# Altium schematic sheet Power.SchDoc
size A3
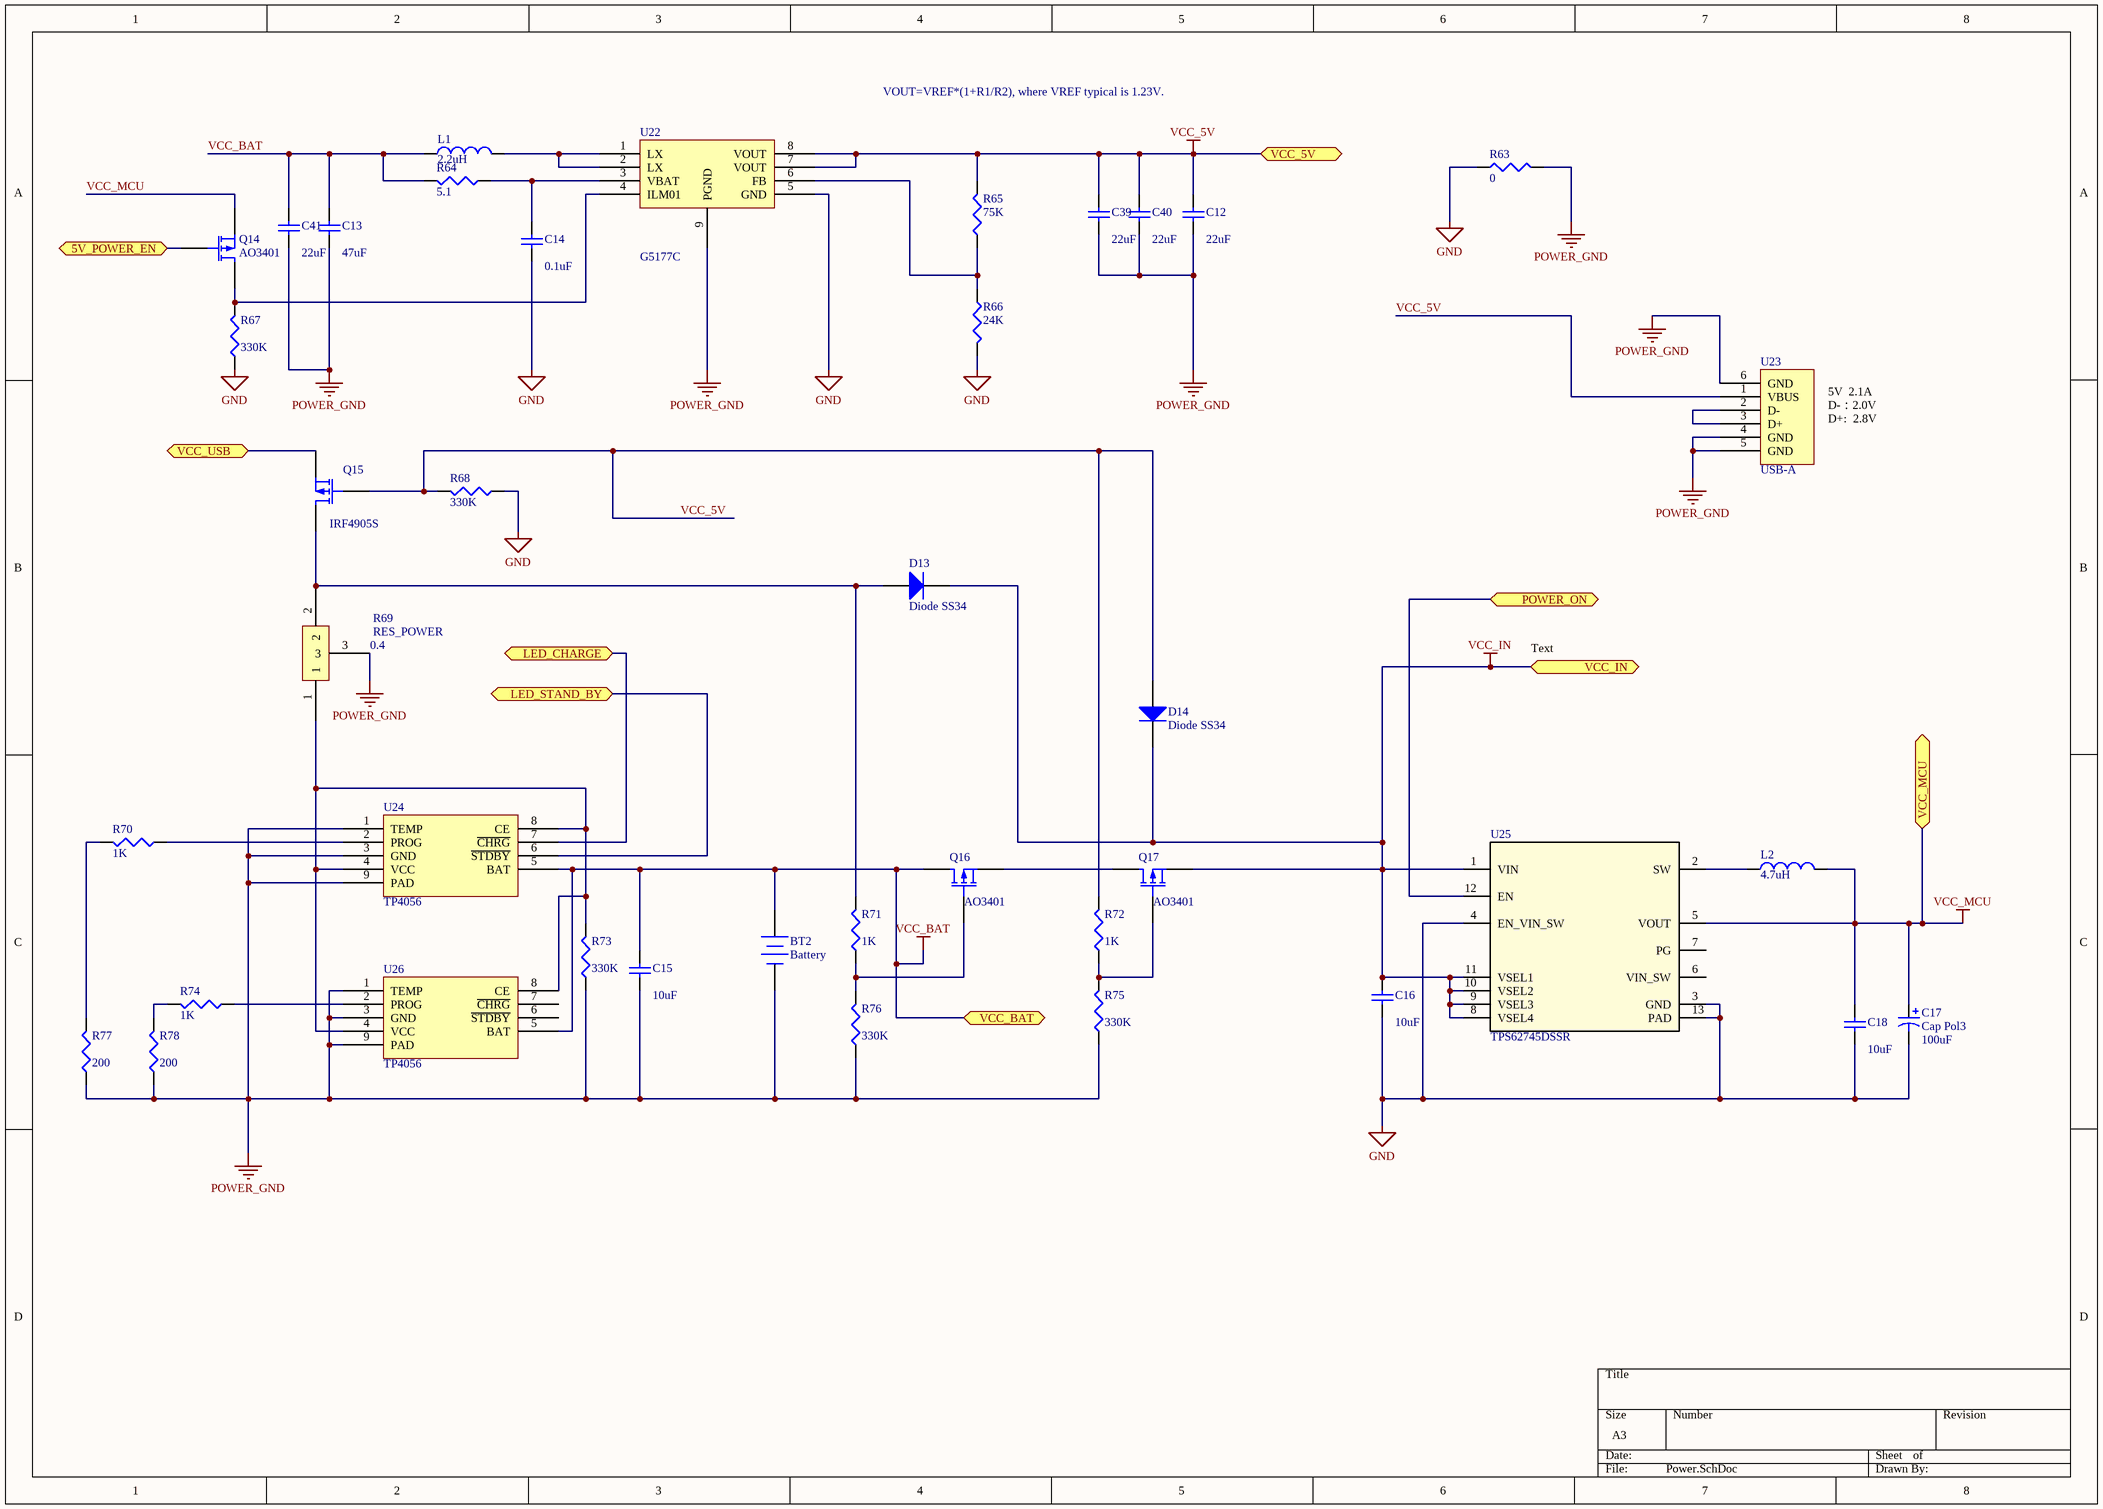
[diagram p0: Power.SchDoc]

## Parts
BT2  Battery  [18650X4]
C12  value 22uF  [1206]  (hidden comment: Cap Semi)
C13  value 47uF  [1210]  (hidden comment: Cap Semi)
C14  value 0.1uF  [0603]  (hidden comment: Cap Semi)
C15  value 10uF  [0603]  (hidden comment: Cap Semi)
C16  value 10uF  [0603]  (hidden comment: Cap Semi)
C17  Cap Pol3  value 100uF  [TC7343-2917]
C18  value 10uF  [0603]  (hidden comment: Cap Semi)
C39  value 22uF  [1206]  (hidden comment: Cap Semi)
C40  value 22uF  [1206]  (hidden comment: Cap Semi)
C41  value 22uF  [1206]  (hidden comment: Cap Semi)
D13  Diode SS34  [SMA]
D14  Diode SS34  [SMA]
L1  value 2.2uH  [WNC0630]  (hidden comment: Inductor)
L2  value 4.7uH  [2520]  (hidden comment: Inductor)
Q14  AO3401  [SOT23-3-PMOS]
Q15  IRF4905S  [D2PAK]
Q16  AO3401  [SOT23-3-PMOS]
Q17  AO3401  [SOT23-3-PMOS]
R63  value 0  [0603]  (hidden comment: Res3)
R64  value 5.1  [0603]  (hidden comment: Res3)
R65  value 75K  [0603]  (hidden comment: Res3)
R66  value 24K  [0603]  (hidden comment: Res3)
R67  value 330K  [0603]  (hidden comment: Res3)
R68  value 330K  [0603]  (hidden comment: Res3)
R69  RES_POWER  value 0.4  [RES_POWER]
R70  value 1K  [0603]  (hidden comment: Res3)
R71  value 1K  [0603]  (hidden comment: Res3)
R72  value 1K  [0603]  (hidden comment: Res3)
R73  value 330K  [0603]  (hidden comment: Res3)
R74  value 1K  [0603]  (hidden comment: Res3)
R75  value 330K  [0603]  (hidden comment: Res3)
R76  value 330K  [0603]  (hidden comment: Res3)
R77  value 200  [0603]  (hidden comment: Res3)
R78  value 200  [0603]  (hidden comment: Res3)
U22  G5177C  [SOP8-PAD]
U23  USB-A  [USB2.5-2H4C]
U24  TP4056  [SOP8-PAD]
U25  TPS62745DSSR  [DSS0012A]
U26  TP4056  [SOP8-PAD]

## Ports
5V_POWER_EN (bidir), LED_CHARGE (bidir), LED_STAND_BY (bidir), POWER_ON (bidir), VCC_5V (bidir), VCC_BAT (bidir), VCC_IN (bidir), VCC_MCU (bidir), VCC_USB (bidir)

## Nets
GND: C14.1 C16.1 C17.2 C18.1 R63.1 R66.2 R67.1 R68.1 U22.5(GND) U25.3(GND) U25.4(EN_VIN_SW) U25.13(PAD)
POWER_GND: BT2.2(-) C12.1 C13.1 C15.1 C39.1 C40.1 C41.1 R63.2 R69.3 R73.1 R75.1 R76.1 R77.1 R78.1 U22.9(PGND) U23.4(GND) U23.5(GND) U23.6(GND) U24.1(TEMP) U24.3(GND) U24.9(PAD) U26.1(TEMP) U26.3(GND) U26.9(PAD)
VCC_5V: C12.2 C39.2 C40.2 D14.1(A) Q15.2(G) R65.2 R68.2 R72.2 U22.7(VOUT) U22.8(VOUT) U23.1(VBUS) ; port VCC_5V
VCC_BAT: BT2.1(+) C13.2 C15.2 C41.2 L1.1 Q16.1(D) R64.2 U24.5(BAT) U26.5(BAT) ; port VCC_BAT
VCC_IN: C16.2 D13.2(K) D14.2(K) Q17.3(S) U25.1(VIN) U25.8(VSEL4) U25.9(VSEL3) U25.10(VSEL2) U25.11(VSEL1) ; port VCC_IN
VCC_MCU: C17.1 C18.2 L2.2 Q14.3(S) U25.5(VOUT) ; port VCC_MCU
5V_POWER_EN: Q14.2(G) ; port 5V_POWER_EN
LED_CHARGE: U24.7(~{CHRG}) ; port LED_CHARGE
LED_STAND_BY: U24.6(~{STDBY}) ; port LED_STAND_BY
POWER_ON: U25.12(EN) ; port POWER_ON
VCC_USB: Q15.3(S) ; port VCC_USB
NetC14_2: C14.2 R64.1 U22.3(VBAT)
NetD13_1: D13.1(A) Q15.1(D) R69.2 R71.2
NetL1_2: L1.2 U22.1(LX) U22.2(LX)
NetL2_1: L2.1 U25.2(SW)
NetQ14_1: Q14.1(D) R67.2 U22.4(ILM01)
NetQ16_2: Q16.2(G) R71.1 R76.2
NetQ16_3: Q16.3(S) Q17.1(D)
NetQ17_2: Q17.2(G) R72.1 R75.2
NetR65_1: R65.1 R66.1 U22.6(FB)
NetR69_1: R69.1 R73.2 U24.4(VCC) U24.8(CE) U26.4(VCC) U26.8(CE)
NetR70_1: R70.1 U24.2(PROG)
NetR70_2: R70.2 R77.2
NetR74_1: R74.1 U26.2(PROG)
NetR74_2: R74.2 R78.2
NetU23_2: U23.2(D-) U23.3(D+)

Not connected (* = marked no-connect by the designer): U25 6(VIN_SW) 7(PG); U26 6(~{STDBY}) 7(~{CHRG})

## Notes on the sheet
- VOUT=VREF*(1+R1/R2), where VREF typical is 1.23V.
- 5V  2.1A
  D-：2.0V
  D+:  2.8V
- Text

## Library data of the parts
BT2 = Battery: Multicell Battery; Published: 24-Mar-1999; LatestRevisionDate: 17-Jul-2002; LatestRevisionNote: Re-released for DXP Platform.; PackageReference: BAT-2; Publisher: Altium Limited; PackageDescription: Battery; 2 Leads
C12-C16 C18 C39-C41 = Cap Semi: Capacitor (Semiconductor SIM Model); Published: 8-Jun-2000; LatestRevisionDate: 29-May-2009; LatestRevisionNote: IPC-7351 Footprint Added.; PackageReference: C1206; Publisher: Altium Limited; PackageDescription: Chip Capacitor
C17 = Cap Pol3: Polarized Capacitor (Surface Mount); Published: 8-Jun-2000; LatestRevisionDate: 29-May-2009; LatestRevisionNote: IPC-7351 Footprint Added.; PackageReference: C0805; Publisher: Altium Limited; PackageDescription: Chip Capacitor
D13 D14 = Diode 1N4005: 1 Amp General Purpose Rectifier; Published: 8-Jun-2000; LatestRevisionDate: 17-Jul-2002; LatestRevisionNote: Re-released for DXP Platform.; DatasheetVersion: 1998; PackageVersion: Aug-1999; PackageReference: DO-41; Publisher: Altium Limited; PackageDescription: Diode, Axial; Body 5.2 x 2.7 mm (LxDia. max), Lead Dia. 0.86 mm (max); Code_JEDEC: DO-204-AL; ComponentLink1Description: Manufacturer Link; ComponentLink1URL: http://www.fairchildsemi.com/; ComponentLink2Description: Datasheet; ComponentLink2URL: http://www.fairchildsemi.com/ds/1N%2F1N4001.pdf
L1 L2 = Inductor: Code_IEC: 1005; Published: 8-Jun-2000; LatestRevisionDate: 29-May-2009; LatestRevisionNote: IPC-7351 Footprint Added.; PackageReference: 0402-A; Publisher: Altium Limited; PackageDescription: Chip Inductor; Code_JEITA: 0402
Q14-Q17 = MOSFET-P: P-Channel MOSFET; Published: 8-Jun-2000; LatestRevisionDate: 17-Jul-2002; LatestRevisionNote: Re-released for DXP Platform.; PackageVersion: 1995/1996; PackageReference: E3; Publisher: Altium Limited; PackageDescription: TO, Flat Index; 3 In-Line, Axial Leads; Body Dia. 4.6mm; Lead Dia. 0.5 mm (max)
R63-R68 R70-R78 = Res3: Resistor; Published: 8-Jun-2000; LatestRevisionDate: 29-May-2009; LatestRevisionNote: IPC-7351 Footprint Added.; PackageReference: J1-0603; Publisher: Altium Limited; PackageDescription: Chip Resistor
U25 = TPS62745DSSR: Imported; Alternate PartNumber: TPS62745DSST; Manufacturer: Texas Instruments; CompType: IC; PIN_COUNT: 13; Application_BuildNumber: *; PartNumber: TPS62745DSSR; PackageReference: DSS0012A; MountType: SMT; RoHS: Y; RefDes: RefDes; Type: DEV